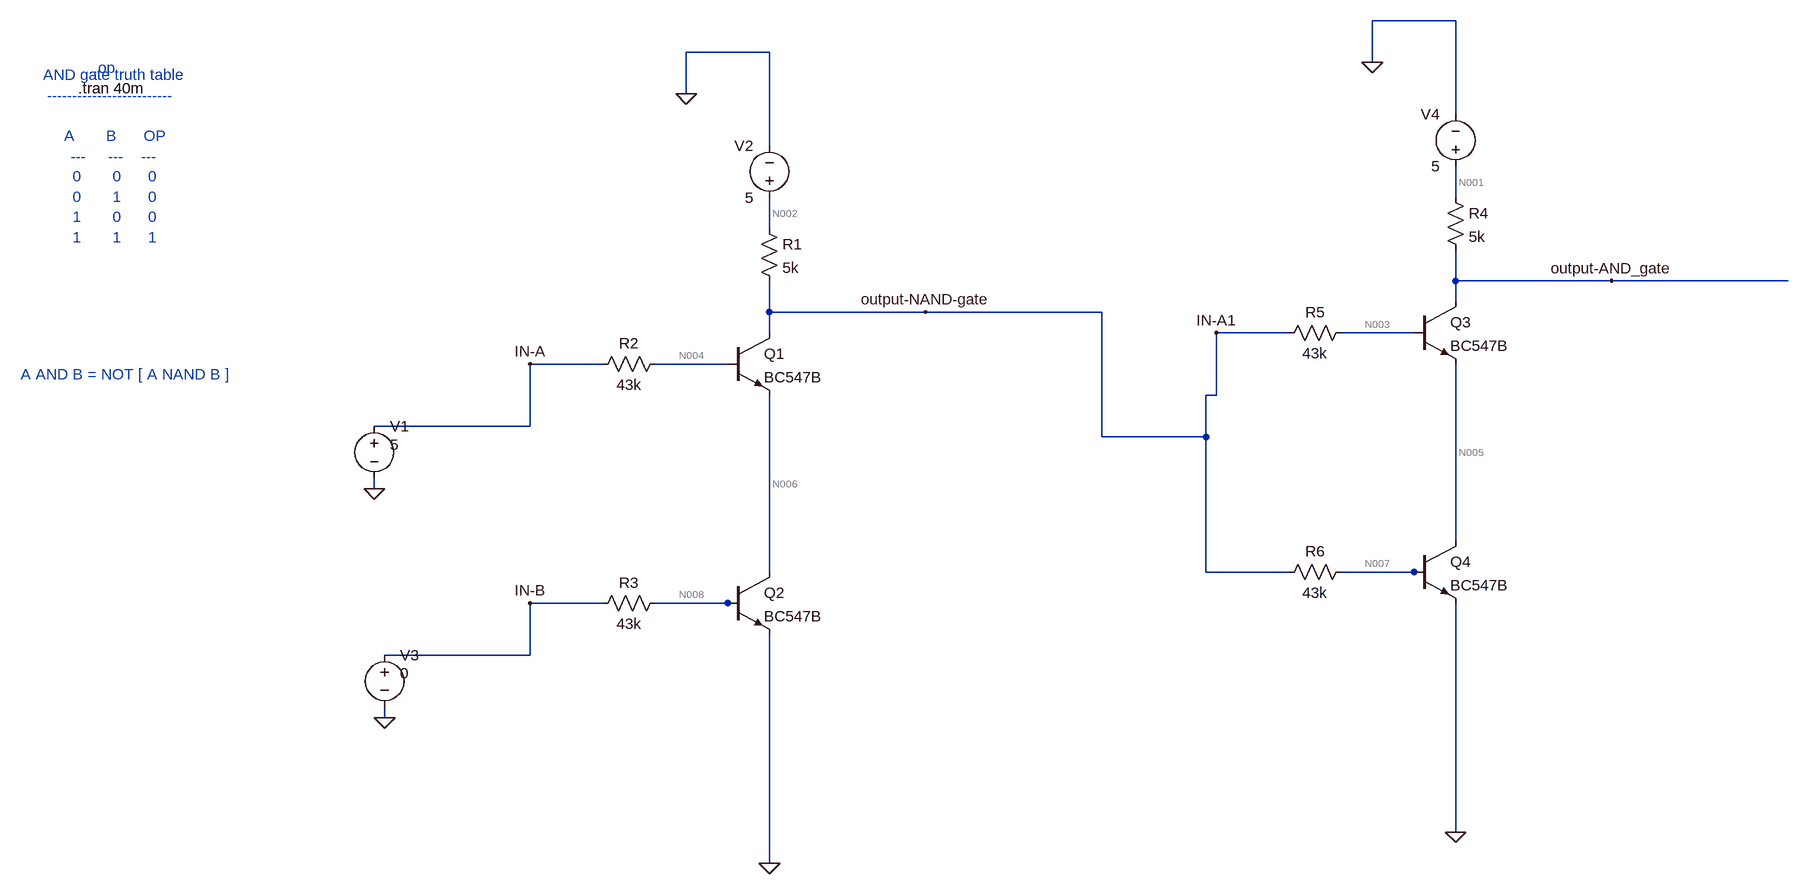
[diagram p0: schematic AND_gate_using_NAND_gate.asc]
AND_gate_using_NAND_gate.asc, the LTspice schematic file:
Version 4.1
SHEET 1 2536 1052
WIRE 1408 -416 1280 -416
WIRE 352 -368 224 -368
WIRE 1280 -352 1280 -416
WIRE 224 -304 224 -368
WIRE 1408 -272 1408 -416
WIRE 352 -224 352 -368
WIRE 1408 -144 1408 -192
WIRE 352 -96 352 -144
WIRE 1408 -16 1408 -64
WIRE 1648 -16 1408 -16
WIRE 1920 -16 1648 -16
WIRE 1408 16 1408 -16
WIRE 352 32 352 -16
WIRE 592 32 352 32
WIRE 864 32 592 32
WIRE 352 64 352 32
WIRE 1152 64 1040 64
WIRE 1344 64 1232 64
WIRE 96 112 -16 112
WIRE 288 112 176 112
WIRE 1040 160 1040 64
WIRE 1040 160 1024 160
WIRE -16 208 -16 112
WIRE -16 208 -256 208
WIRE 864 224 864 32
WIRE 1024 224 1024 160
WIRE 1024 224 864 224
WIRE -256 304 -256 288
WIRE 1408 384 1408 112
WIRE 352 432 352 160
WIRE 1024 432 1024 224
WIRE 1152 432 1024 432
WIRE 1344 432 1232 432
WIRE 1360 432 1344 432
WIRE 96 480 -16 480
WIRE 288 480 176 480
WIRE 304 480 288 480
WIRE -16 560 -16 480
WIRE -16 560 -240 560
WIRE -240 656 -240 640
WIRE 1408 832 1408 480
WIRE 352 880 352 528
FLAG -16 112 IN-A
FLAG -256 304 0
FLAG 224 -304 0
FLAG 592 32 output-NAND-gate
FLAG 352 880 0
FLAG -240 656 0
FLAG -16 480 IN-B
FLAG 1040 64 IN-A1
FLAG 1280 -352 0
FLAG 1648 -16 output-AND_gate
FLAG 1408 832 0
SYMBOL voltage -256 192 R0
WINDOW 3 24 44 Left 2
WINDOW 123 0 0 Left 0
WINDOW 39 0 0 Left 0
SYMATTR Value 5
SYMATTR InstName V1
SYMBOL npn 288 64 R0
SYMATTR InstName Q1
SYMATTR Value BC547B
SYMBOL voltage 352 -128 R180
WINDOW 0 24 96 Left 2
WINDOW 3 24 16 Left 2
WINDOW 123 0 0 Left 0
WINDOW 39 0 0 Left 0
SYMATTR InstName V2
SYMATTR Value 5
SYMBOL res 336 -112 R0
SYMATTR InstName R1
SYMATTR Value 5k
SYMBOL res 192 96 R90
WINDOW 0 0 56 VBottom 2
WINDOW 3 32 56 VTop 2
SYMATTR InstName R2
SYMATTR Value 43k
SYMBOL npn 288 432 R0
SYMATTR InstName Q2
SYMATTR Value BC547B
SYMBOL res 192 464 R90
WINDOW 0 0 56 VBottom 2
WINDOW 3 32 56 VTop 2
SYMATTR InstName R3
SYMATTR Value 43k
SYMBOL voltage -240 544 R0
WINDOW 3 24 44 Left 2
WINDOW 123 0 0 Left 0
WINDOW 39 0 0 Left 0
SYMATTR Value 0
SYMATTR InstName V3
SYMBOL npn 1344 16 R0
SYMATTR InstName Q3
SYMATTR Value BC547B
SYMBOL voltage 1408 -176 R180
WINDOW 0 24 96 Left 2
WINDOW 3 24 16 Left 2
WINDOW 123 0 0 Left 0
WINDOW 39 0 0 Left 0
SYMATTR InstName V4
SYMATTR Value 5
SYMBOL res 1392 -160 R0
SYMATTR InstName R4
SYMATTR Value 5k
SYMBOL res 1248 48 R90
WINDOW 0 0 56 VBottom 2
WINDOW 3 32 56 VTop 2
SYMATTR InstName R5
SYMATTR Value 43k
SYMBOL npn 1344 384 R0
SYMATTR InstName Q4
SYMATTR Value BC547B
SYMBOL res 1248 416 R90
WINDOW 0 0 56 VBottom 2
WINDOW 3 32 56 VTop 2
SYMATTR InstName R6
SYMATTR Value 43k
TEXT -712 -312 Left 2 !.tran 40m
TEXT -688 -344 Left 2 ;.op
TEXT -656 -208 Center 2 ;AND gate truth table\n-------------------------\n \nA       B      OP\n---     ---    ---\n0       0      0\n0       1      0\n1       0      0\n1       1      1
TEXT -800 128 Left 2 ;A AND B = NOT [ A NAND B ]

The netlist it stands for:
* AND_gate_using_NAND_gate.asc
V1 IN-A 0 5
Q1 IN-A1 N004 N006 0 BC547B
V2 N002 0 5
R1 N002 IN-A1 5k
R2 N004 IN-A 43k
Q2 N006 N008 0 0 BC547B
R3 N008 IN-B 43k
V3 IN-B 0 0
Q3 output-AND_gate N003 N005 0 BC547B
V4 N001 0 5
R4 N001 output-AND_gate 5k
R5 N003 IN-A1 43k
Q4 N005 N007 0 0 BC547B
R6 N007 IN-A1 43k
.model NPN NPN
.model PNP PNP
.lib standard.bjt
.tran 40m
* .op
* AND gate truth table
* -------------------------
* A       B      OP
* ---     ---    ---
* 0       0      0
* 0       1      0
* 1       0      0
* 1       1      1
* A AND B = NOT [ A NAND B ]
.backanno
.end

* Results of the author's LTspice run, read from the files saved beside the schematic
* Operating Point, zero values left out:
*   V(in-a1) = 4.206 V
*   V(n006) = 4.204 V
*   V(n002) = 5 V
*   V(n005) = 35.83 mV
*   V(n007) = 652.2 mV
*   V(in-a) = 5 V
*   V(n004) = 4.753 V
*   V(n008) = 183.6 nV
*   V(output-and_gate) = 70.3 mV
*   V(n003) = 686.6 mV
*   V(n001) = 5 V
*   I(V1) = -5.753 µA
*   I(R2) = -5.753 µA
*   Ic(Q2) = 4.296 pA
*   Ib(Q2) = -4.27 pA
*   I(R4) = 985.9 µA
*   I(R6) = -82.65 µA
*   I(V2) = -158.8 µA
*   I(V3) = 4.27 pA
*   Ic(Q4) = 1.068 mA
*   Ib(Q4) = 82.65 µA
*   Ie(Q4) = -1.15 mA
*   Ic(Q1) = -5.753 µA
*   Ib(Q1) = 5.753 µA
*   Ie(Q1) = -4.296 pA
*   I(R3) = 4.27 pA
*   I(R5) = -81.85 µA
*   I(R1) = 158.8 µA
*   Ic(Q3) = 985.9 µA
*   Ib(Q3) = 81.85 µA
*   Ie(Q3) = -1.068 mA
*   I(V4) = -985.9 µA